# EAGLE design main (EAGLE 6.4)
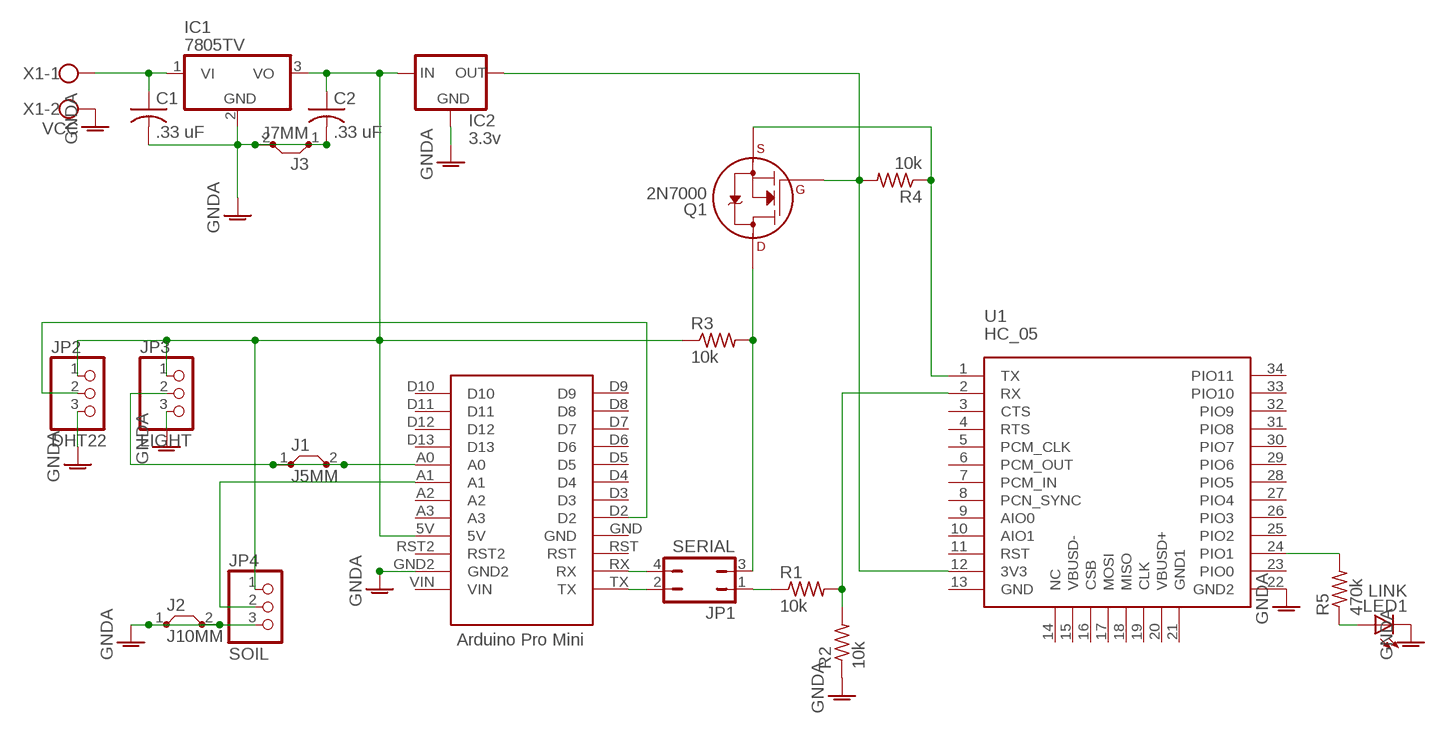
[diagram p0: schematic, sheet 1]

## Parts
C1  .33 uF  C-US025-050X050  [C025-050X050]
C2  .33 uF  C-US025-050X050  [C025-050X050]
IC1  7805TV  [TO220V]
IC2  3.3v  MCP1700INLINE  [TO92-INLINE]
J1  J5MM  [05]
J2  J10MM  [10]
J3  J7MM  [07]
JP1  SERIAL  JP2Q  [JP2Q]
JP2  DHT22  PINHD-1X3  [1X03]
JP3  LIGHT  PINHD-1X3  [1X03]
JP4  SOIL  PINHD-1X3  [1X03]
LED1  LINK  LED3MM  [LED3MM]
Q1  2N7000  2N7000_TO92  [TO-92]
R1  10k  R-US_0204/7  [0204/7]
R2  10k  R-US_0204/7  [0204/7]
R3  10k  R-US_0204/7  [0204/7]
R4  10k  R-US_0204/7  [0204/7]
R5  470k  R-US_0204/7  [0204/7]
U1  HC_05  [BLUETOOTH_SMD]
U$1  ARDUINO_PRO_MINI_5V_V1V1  [ARDUINO_PRO_MINI_5V_V1]
X1  VCC  W237-102  [W237-102]

## Nets
GNDA: C1.2 C2.2 IC1.2(GND) IC2.1(GND) J2.1 J2.2 J3.1 J3.2 JP2.3 JP3.3 JP4.3 LED1.K(C) R2.1 U1.22(GND2) U$1.GND2 X1.2
N$1: IC2.3(OUT) Q1.2(G) R4.2 U1.12(3V3)
N$3: JP1.2 U$1.TX
N$4: R1.2 R2.2 U1.2(RX)
N$5: C1.1 IC1.1(VI) X1.1
N$6: JP1.3 Q1.3(D) R3.2
N$7: Q1.1(S) R4.1 U1.1(TX)
N$8: JP1.1 R1.1
N$9: JP1.4 U$1.RX
N$10: LED1.A R5.1
N$11: R5.2 U1.24(PIO1)
N$12: C2.1 IC1.3(VO) IC2.2(IN) JP2.1 JP3.1 JP4.1 R3.1 U$1.5V
N$13: J1.1 J1.2 JP3.2 U$1.A0
N$14: JP4.2 U$1.A1
N$15: JP2.2 U$1.D2
Unconnected: U1.3(CTS) U1.4(RTS) U1.5(PCM_CLK) U1.6(PCM_OUT) U1.7(PCM_IN) U1.8(PCN_SYNC) U1.9(AIO0) U1.10(AIO1) U1.11(RST) U1.13(GND) U1.14(NC) U1.15(VBUSD-) U1.16(CSB) U1.17(MOSI) U1.18(MISO) U1.19(CLK) U1.20(VBUSD+) U1.21(GND1) U1.23(PIO0) U1.25(PIO2) U1.26(PIO3) U1.27(PIO4) U1.28(PIO5) U1.29(PIO6) U1.30(PIO7) U1.31(PIO8) U1.32(PIO9) U1.33(PIO10) U1.34(PIO11) U$1.A2 U$1.A3 U$1.D3 U$1.D4 U$1.D5 U$1.D6 U$1.D7 U$1.D8 U$1.D9 U$1.D10 U$1.D11 U$1.D12 U$1.D13 U$1.GND U$1.RST U$1.RST2 U$1.VIN

## Library data of the parts
C1 C2 = rcl:C-US: CAPACITOR, American symbol
IC1 = linear:78*: Positive VOLTAGE REGULATOR Source: http://cache.national.com/ds/LM/LM78L05.pdf http://www.fairchildsemi.com/ds/LM/LM7805.pdf
IC2 = adafruit:MCP1700: VOLTAGE REGULATOR
J1-J3 = jumper:J: Bridge
JP1 = jumper:JP2Q: JUMPER
JP2-JP4 = pinhead:PINHD-1X3: PIN HEADER
LED1 = led:LED: LED OSRAM: - CHIPLED LG R971, LG N971, LY N971, LG Q971, LY Q971, LO R971, LY R971 LH N974, LH R974 LS Q976, LO Q976, LY Q976 LO Q996 - Hyper CHIPLED LW Q18S LB Q993, LB Q99A, LB R99A - SideLED LS A670, LO A670, LY A670, LG A670, LP A670 LB A673, LV A673, LT A673, LW A673 LH A674 LY A675 LS A676, LA A676, LO A676, LY A676, LW A676 LS A679, LY A679, LG A679 - Hyper Micro SIDELED® LS Y876, LA Y876, LO Y876, LY Y876 LT Y87S - SmartLED LW L88C, LW L88S LB L89C, LB L89S, LG L890 LS L89K, LO L89K, LY L89K LS L896, LA L896, LO L896, LY L896 - TOPLED LS T670, LO T670, LY T670, LG T670, LP T670 LSG T670, LSP T670, LSY T670, LOP T670, LYG T670 LG T671, LOG T671, LSG T671 LB T673, LV T673, LT T673, LW T673 LH T674 LS T676, LA T676, LO T676, LY T676, LB T676, LH T676, LSB T676, LW T676 LB T67C, LV T67C, LT T67C, LS T67K, LO T67K, LY T67K, LW E67C LS E67B, LA E67B, LO E67B, LY E67B, LB E67C, LV E67C, LT E67C LW T67C LS T679, LY T679, LG T679 LS T770, LO T770, LY T770, LG T770, LP T770 LB T773, LV T773, LT T773, LW T773 LH T774 LS E675, LA E675, LY E675, LS T675 LS T776, LA T776, LO T776, LY T776, LB T776 LHGB T686 LT T68C, LB T68C - Hyper Mini TOPLED® LB M676 - Mini TOPLED Santana® LG M470 LS M47K, LO M47K, LY M47K Source: http://www.osram.convergy.de LUXEON: - LUMILED® LXK2-PW12-R00, LXK2-PW12-S00, LXK2-PW14-U00, LXK2-PW14-V00 LXK2-PM12-R00, LXK2-PM12-S00, LXK2-PM14-U00 LXK2-PE12-Q00, LXK2-PE12-R00, LXK2-PE12-S00, LXK2-PE14-T00, LXK2-PE14-U00 LXK2-PB12-K00, LXK2-PB12-L00, LXK2-PB12-M00, LXK2-PB14-N00, LXK2-PB14-P00, LXK2-PB14-Q00 LXK2-PR12-L00, LXK2-PR12-M00, LXK2-PR14-Q00, LXK2-PR14-R00 LXK2-PD12-Q00, LXK2-PD12-R00, LXK2-PD12-S00 LXK2-PH12-R00, LXK2-PH12-S00 LXK2-PL12-P00, LXK2-PL12-Q00, LXK2-PL12-R00 Source: www.luxeon.com KINGBRIGHT: KA-3528ASYC Source: www.kingbright.com
Q1 = transistors:2N700*: 2N7000, 2N7002, NDS7002A N-channel enhancement mode MOSFET
R1-R5 = resistor:R-US_: RESISTOR, American symbol
U1 = SerialPortBluetooth:HC_05
U$1 = ArduinoProMini5V:ARDUINO_PRO_MINI_5V_V1: Arduino Pro Mini 5V/16MHz Version 1: FTDI Pins left on Arduino. All headered pins available.
X1 = con-wago-500:W237-102: WAGO SCREW CLAMP; MPN: 237-102; OC_FARNELL: unknown; OC_NEWARK: 70K9898

## Net classes
0 default: width 0.381 mm

## Board
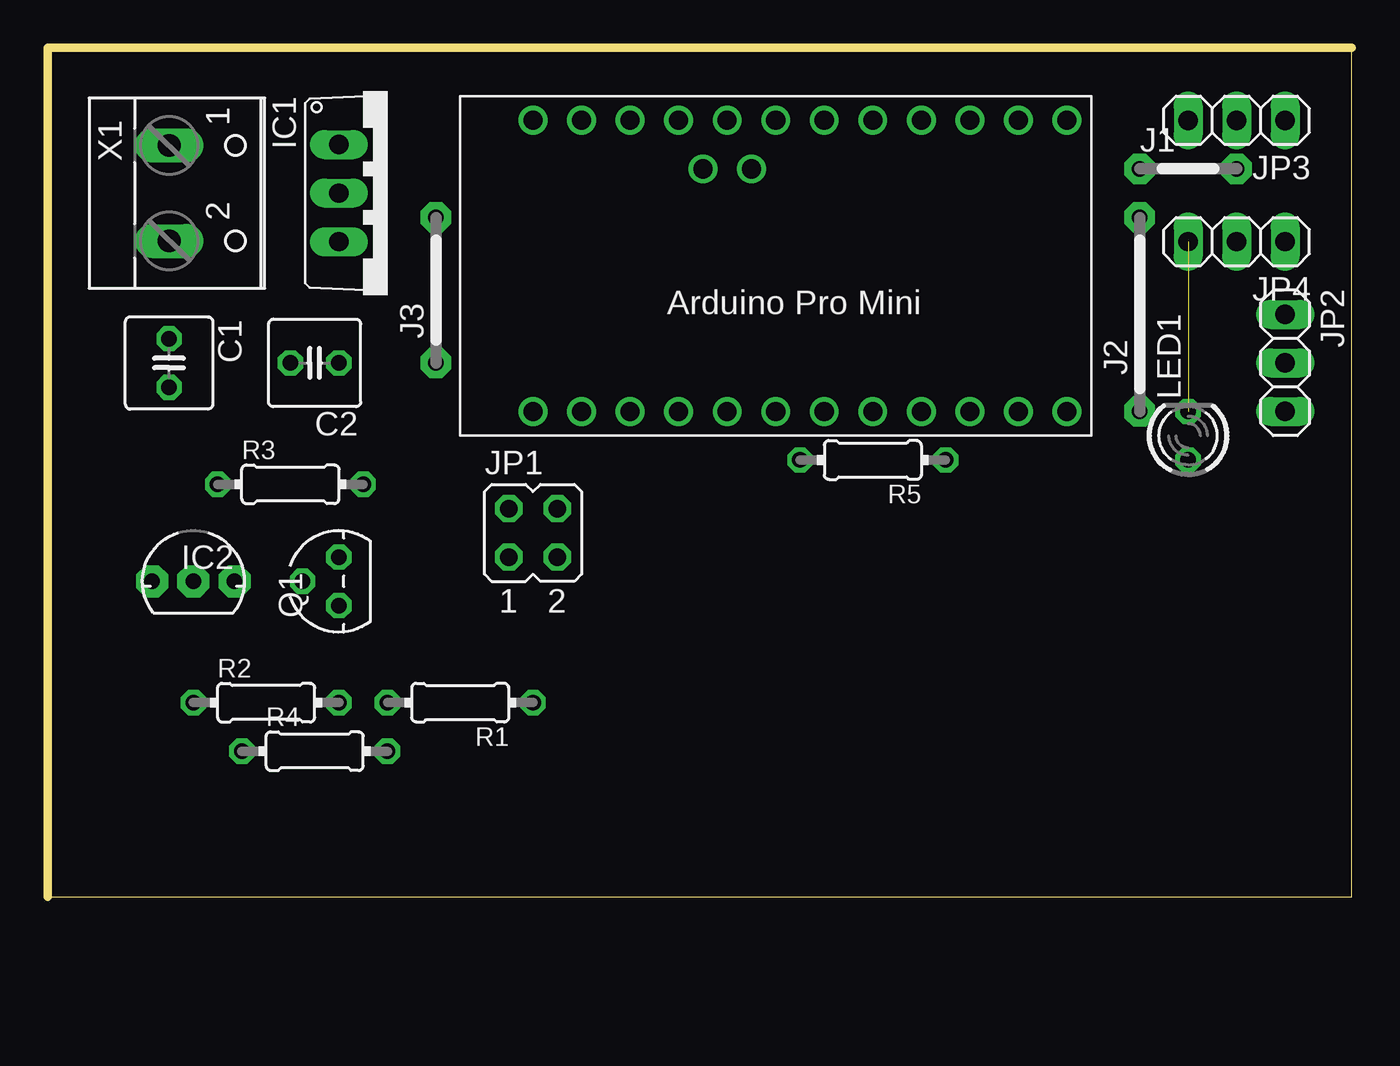
[diagram p1: board, top side]
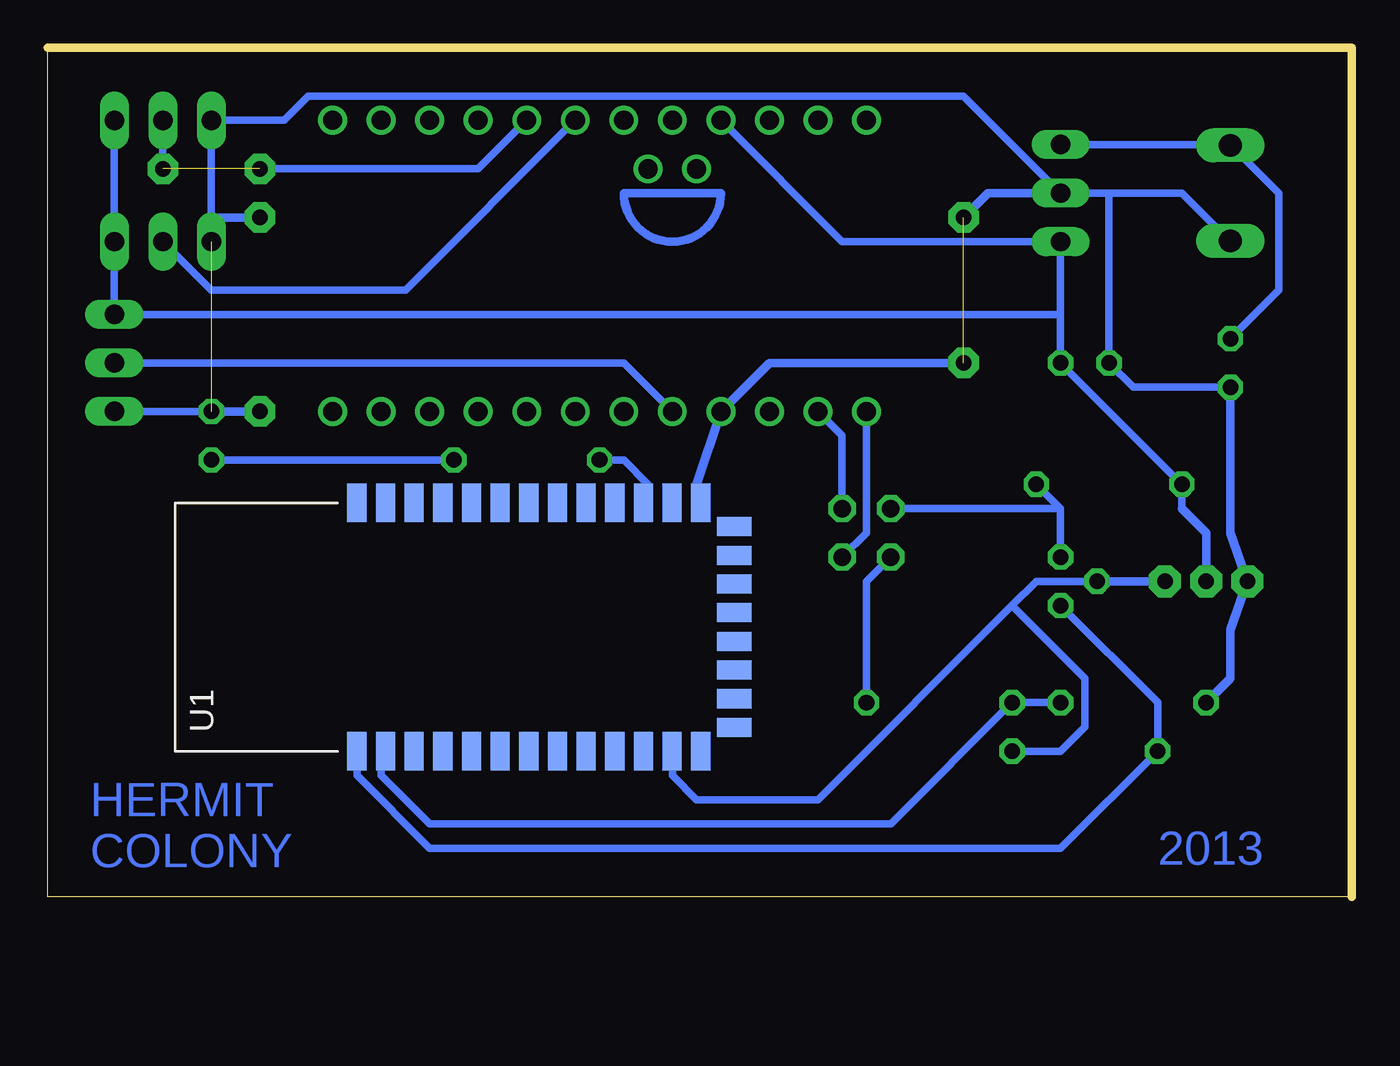
[diagram p2: board, bottom side, seen from below]

Size 68.25 x 44.44 mm. Coordinates in mm from the lower left corner, seen from the top.
Outline: 0,0 68.25,0 68.25,44.44 0,44.44 0,0
Copper layers (1*16): Top 0.035mm / dielectric 1.5mm / Bottom 0.035mm
Design rules "default": minimum track width 10mil, minimum drill 24mil, track to track 8mil, track to pad 8mil, pad to pad 8mil, via to via 8mil, smd to smd 8mil, copper to edge 40mil, drill to drill 8mil, minimum pad ring 10mil, minimum via ring 8mil, stop-mask expansion 4mil, vias tented up to drill 0mil, thermal gap 10mil

### Footprints (pad centres in the part's own frame; a part is rotated, then mirrored left to right if it is on the bottom)
C025-050X050 = drill 0.813 octagon: 1 -1.27,0; 2 1.27,0
TO220V = drill 1.016 long: 1 -2.54,-2.54; 2 0,-2.54; 3 2.54,-2.54
TO92-INLINE = drill 0.813 pad 1.676 octagon: 1 -2.159,0; 2 0,0; 3 2.159,0
05 = drill 0.813 pad 1.6 octagon: 1 -2.54,0; 2 2.54,0
10 = drill 0.813 pad 1.6 octagon: 1 -5.08,0; 2 5.08,0
07 = drill 0.813 pad 1.6 octagon: 1 -3.81,0; 2 3.81,0
JP2Q = drill 0.914 octagon: 1 -1.27,-1.27; 2 1.27,-1.27; 3 -1.27,1.27; 4 1.27,1.27
1X03 = drill 1.016 long: 1 -2.54,0; 2 0,0; 3 2.54,0
LED3MM = drill 0.813 octagon: A -1.27,0; K 1.27,0
TO-92 = drill 0.813 octagon: 1 -1.27,0; 2 0,1.905; 3 1.27,0
0204/7 = drill 0.813 octagon: 1 -3.81,0; 2 3.81,0
BLUETOOTH_SMD = smd 2 x 1: 1 0,0; 2 0,-1.5; 3 0,-3; 4 0,-4.5; 5 0,-6; 6 0,-7.5; 7 0,-9; 8 0,-10.5; 9 0,-12; 10 0,-13.5; 11 0,-15; 12 0,-16.5; 13 0,-18; 22 13,-18; 23 13,-16.5; 24 13,-15; 25 13,-13.5; 26 13,-12; 27 13,-10.5; 28 13,-9; 29 13,-7.5; 30 13,-6; 31 13,-4.5; 32 13,-3; 33 13,-1.5; 34 13,0 | smd 1 x 1.8: 14 1.25,-19.75; 15 2.75,-19.75; 16 4.25,-19.75; 17 5.75,-19.75; 18 7.25,-19.75; 19 8.75,-19.75; 20 10.25,-19.75; 21 11.75,-19.75
ARDUINO_PRO_MINI_5V_V1 = drill 1: 5V 7.62,8.89; A0 7.62,-1.27; A1 7.62,1.27; A2 7.62,3.81; A3 7.62,6.35; A4 5.08,5.08; A5 5.08,7.62; D2 -7.62,6.35; D3 -7.62,3.81; D4 -7.62,1.27; D5 -7.62,-1.27; D6 -7.62,-3.81; D7 -7.62,-6.35; D8 -7.62,-8.89; D9 -7.62,-11.43; D10 7.62,-11.43; D11 7.62,-8.89; D12 7.62,-6.35; D13 7.62,-3.81; GND 7.62,13.97; GND2 -7.62,8.89; RST -7.62,11.43; RST2 7.62,11.43; RX -7.62,13.97; TX -7.62,16.51; VIN 7.62,16.51
W237-102 = drill 1.194 long: 1 -2.5,-1.27; 2 2.5,-1.27

### Placement (x,y rotation side)
C1  6.35,27.94 270 top
C2  13.97,27.94 180 top
IC1  17.78,36.83 270 top
IC2  7.62,16.51 0 top
J1  59.69,38.1 0 top
J2  57.15,30.48 90 top
J3  20.32,31.75 90 top
JP1  25.4,19.05 0 top
JP2  64.77,27.94 270 top
JP3  62.23,40.64 180 top
JP4  62.23,34.29 180 top
LED1  59.69,24.13 90 top
Q1  15.24,16.51 90 top
R1  21.59,10.16 180 top
R2  11.43,10.16 0 top
R3  12.7,21.59 0 top
R4  13.97,7.62 0 top
R5  43.18,22.86 180 top
U1  52.07,7.62 90 bottom
U$1  41.91,33.02 90 top
X1  7.62,36.83 270 top

### Tracks (layer width: path | path; a pad name or v marks a point on that pad's centre or on a via)
GNDA  (2 unrouted)
  Bottom 0.381: 34.29,21.59 U1.22 | JP2.3 LED1.K | C1.2 11.43,26.67 C2.2 12.7,36.83 | JP4.3 JP3.3 55.88,40.64 54.61,41.91 20.32,41.91 IC1.2 12.7,36.83 | 12.7,36.83 8.89,36.83 6.35,34.29 X1.2
  Bottom 0.457: J2.1 LED1.K | JP4.3 59.69,35.56 J2.2 | C1.2 6.35,19.05 IC2.1 6.35,13.97 6.35,11.43 R2.1 | J3.2 19.05,36.83 IC1.2 | J3.1 30.48,27.94 U$1.GND2 34.29,21.59
N$1
  Bottom 0.381: 17.78,15.24 16.51,16.51 Q1.2 12.7,16.51 | 17.78,15.24 27.94,5.08 34.29,5.08 35.56,6.35 U1.12 | R4.2 15.24,7.62 13.97,8.89 13.97,11.43 17.78,15.24
  Bottom 0.457: IC2.3 12.7,16.51
N$2
  Bottom 0.457: 38.1,36.83 arc-180 33.02,36.83 38.1,36.83
N$3
  Bottom 0.381: JP1.2 25.4,19.05 U$1.TX
N$4
  Bottom 0.381: U1.2 50.8,7.62 50.8,6.35 48.26,3.81 24.13,3.81 R1.2 R2.2
N$5
  Bottom 0.381: C1.1 3.81,31.75 3.81,36.83 6.35,39.37 | 6.35,39.37 IC1.1 | 6.35,39.37 X1.1
N$6
  Bottom 0.381: 15.24,20.32 Q1.3 | R3.2 15.24,20.32 | 15.24,20.32 JP1.3
N$7
  Bottom 0.381: U1.1 52.07,6.35 48.26,2.54 15.24,2.54 R4.1 10.16,10.16 Q1.1
N$8
  Bottom 0.381: R1.1 25.4,16.51 JP1.1
N$9
  Bottom 0.381: JP1.4 26.67,24.13 U$1.RX
N$10
  Bottom 0.381: LED1.A R5.1
N$11
  Bottom 0.381: R5.2 38.1,22.86 36.83,21.59 U1.24
N$12
  Bottom 0.381: JP4.1 JP3.1 JP2.1 15.24,30.48 | 8.89,20.32 R3.1 C2.1 15.24,30.48 | 15.24,30.48 IC1.3 26.67,34.29 U$1.5V
  Bottom 0.457: 8.89,20.32 7.62,19.05 IC2.2
N$13  (1 unrouted)
  Bottom 0.381: U$1.A0 45.72,38.1 J1.1 | J1.2 JP3.2
N$14
  Bottom 0.381: U$1.A1 49.53,31.75 59.69,31.75 JP4.2
N$15
  Bottom 0.381: U$1.D2 38.1,27.94 JP2.2

### Text on the board
Bottom: HERMIT / COLONY | 2013